# EAGLE design FDC1004Q (EAGLE 7.3.0)
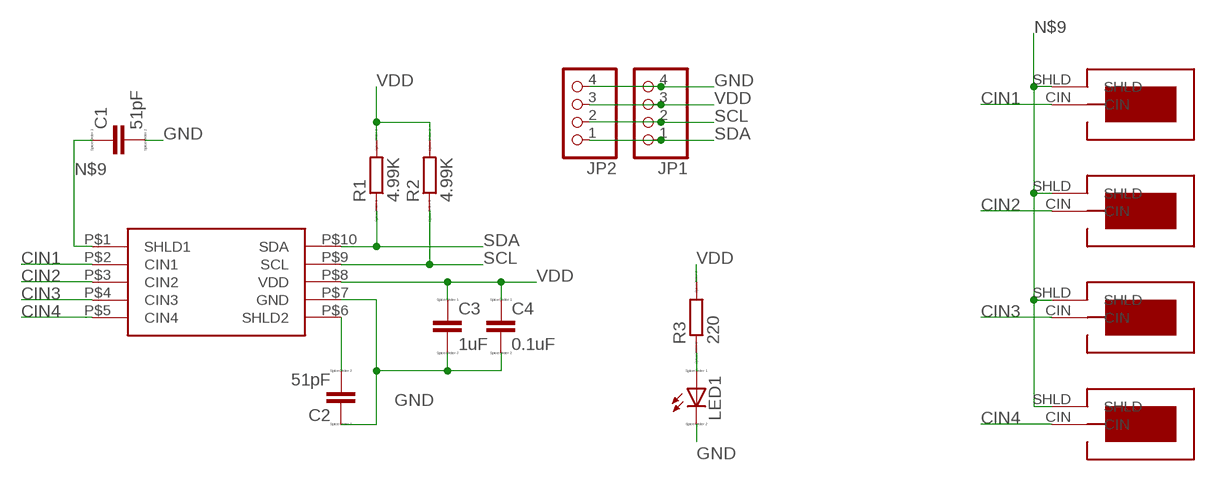
[diagram p0: schematic, sheet 1]

## Parts
C1  51pF  C  [C0805]
C2  51pF  C  [C0805]
C3  1uF  C  [C0805]
C4  0.1uF  C  [C0805]
JP1  PINHD-1X4  [1X04]
JP2  PINHD-1X4  [1X04]
LED1  LED_ESML0603  [LED_SML0603]
R1  4.99K  R  [R0805]
R2  4.99K  R  [R0805]
R3  220  R  [R0805]
SENSOR1  SENSOR  [SENSOR_1X1]
SENSOR2  SENSOR  [SENSOR_1X1]
SENSOR3  SENSOR  [SENSOR_1X1]
SENSOR4  SENSOR  [SENSOR_1X1]
U$1  FDC1004Q  [DGS]

## Nets
CIN1: SENSOR1.CIN U$1.P$2(CIN1)
CIN2: SENSOR2.CIN U$1.P$3(CIN2)
CIN3: SENSOR3.CIN U$1.P$4(CIN3)
CIN4: SENSOR4.CIN U$1.P$5(CIN4)
GND: C1.2 C2.1 C3.2 C4.2 JP1.4 JP2.4 LED1.C U$1.P$7(GND)
N$1: LED1.A R3.1
N$2: C2.2 U$1.P$6(SHLD2)
N$9: C1.1 SENSOR1.SHLD SENSOR2.SHLD SENSOR3.SHLD SENSOR4.SHLD U$1.P$1(SHLD1)
SCL: JP1.2 JP2.2 R2.1 U$1.P$9(SCL)
SDA: JP1.1 JP2.1 R1.1 U$1.P$10(SDA)
VDD: C3.1 C4.1 JP1.3 JP2.3 R1.2 R2.2 R3.2 U$1.P$8(VDD)

## Library data of the parts
C1-C4 = eagle-ltspice:C: CAPACITOR, European symbol; SPICEMODEL: NONE; SPICEPREFIX: C
JP1 JP2 = pinhead:PINHD-1X4: PIN HEADER
LED1 = eagle-ltspice:LED_E: LED Source: http://www.osram.convergy.de Source: www.luxeon.com Source: www.kingbright.com; SPICEMODEL: NONE; SPICEPREFIX: D; SPICETYPE: diode
R1-R3 = eagle-ltspice:R: RESISTOR, European symbol; SPICEMODEL: NONE; SPICEPREFIX: R
SENSOR1-SENSOR4 = DGS:SENSOR
U$1 = DGS:FDC1004Q

## Board
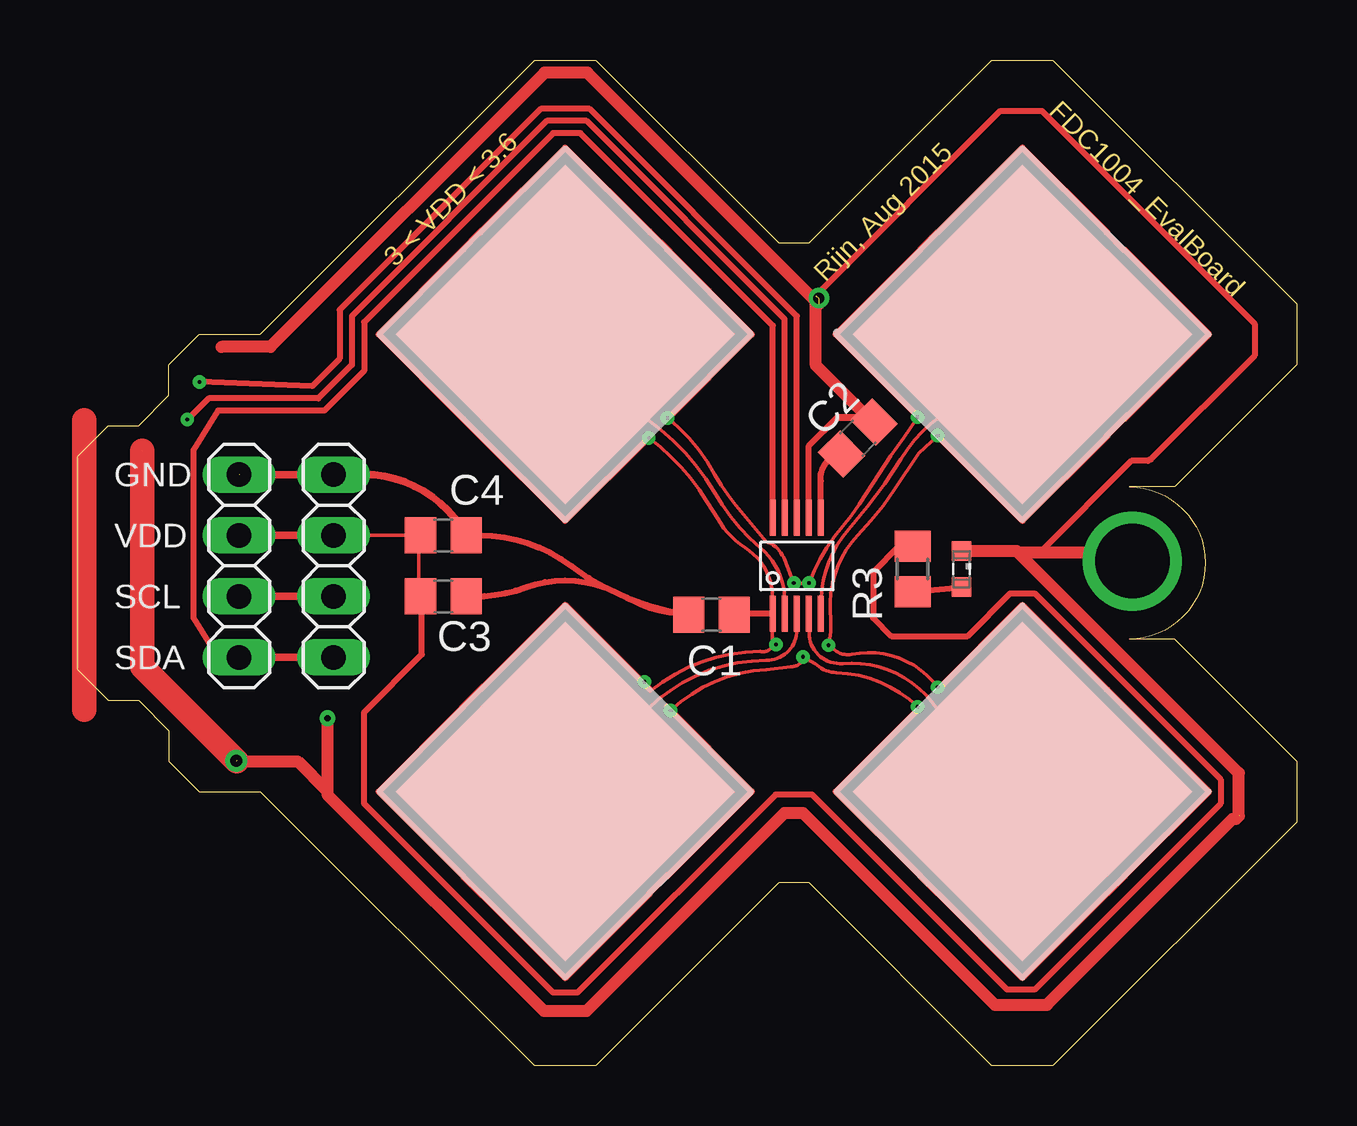
[diagram p1: board, top side]
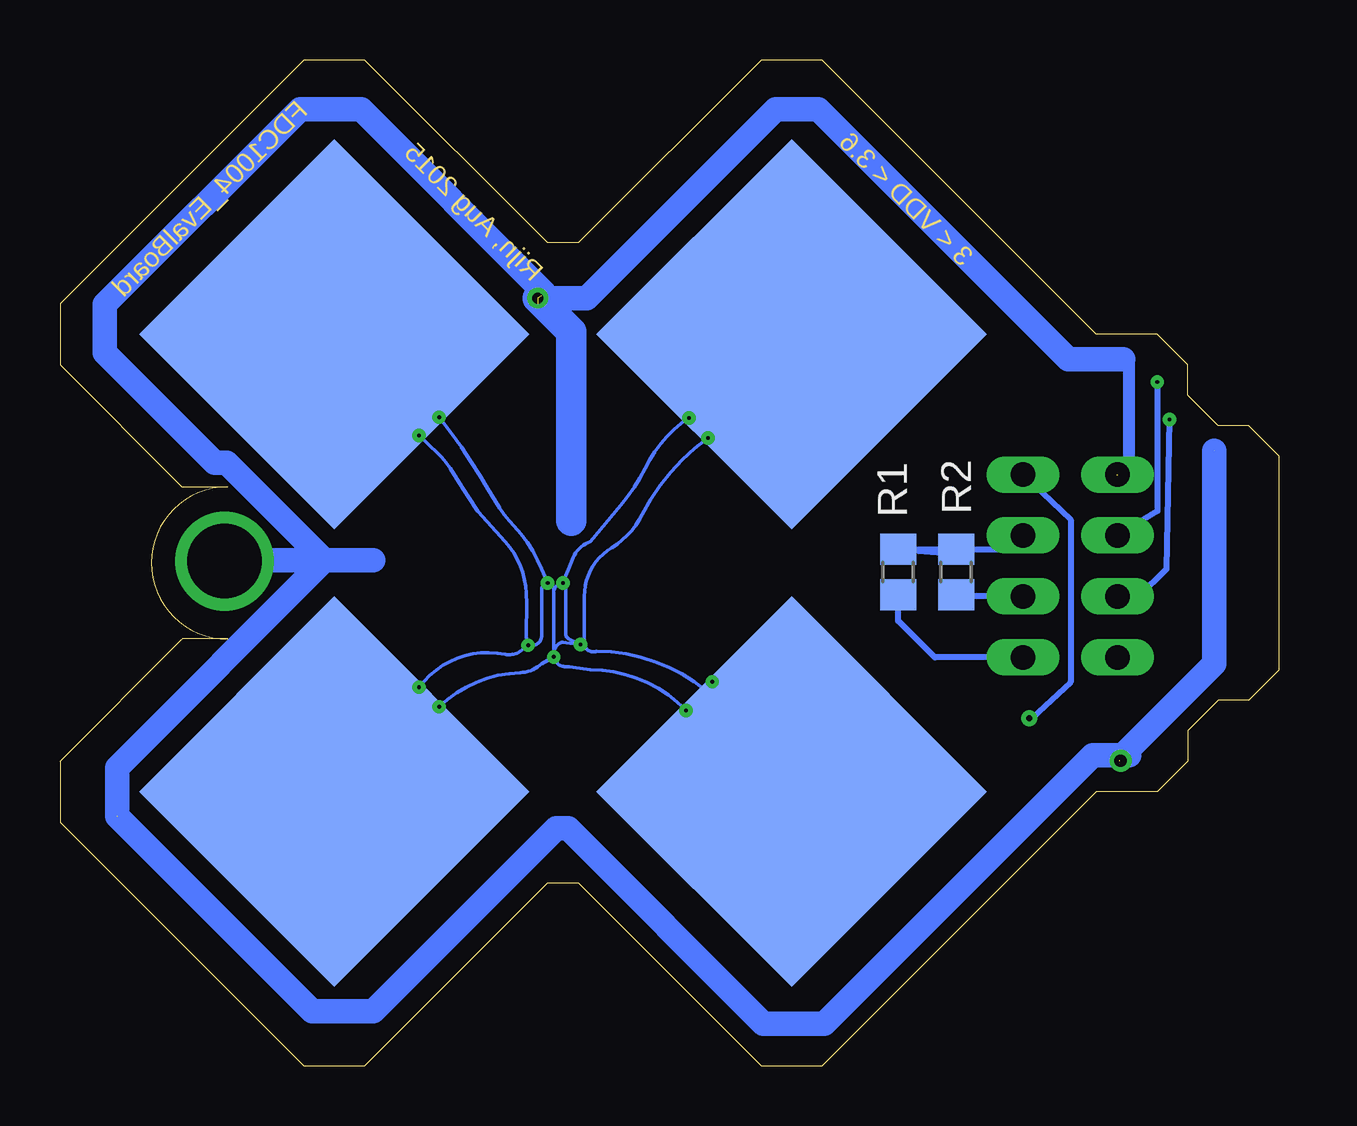
[diagram p2: board, bottom side, seen from below]

Size 50.8 x 41.91 mm. Coordinates in mm from the lower left corner, seen from the top.
Outline: 45.72,17.78 50.8,12.7 50.8,10.16 40.64,0 38.1,0 30.48,7.62 29.21,7.62 21.59,0 19.05,0 7.62,11.43 5.08,11.43 3.81,12.7 3.81,13.97 2.54,15.24 1.27,15.24 0,16.51 0,25.4 1.27,26.67 2.54,26.67 3.81,27.94 3.81,29.21 5.08,30.48 7.62,30.48 19.05,41.91 21.59,41.91 29.21,34.29 30.48,34.29 38.1,41.91 40.64,41.91 50.8,31.75 50.8,29.21 45.72,24.13 43.81,24.13 arc-180 43.81,17.78
Outline: 43.82,17.79 45.7,17.79 45.73,17.76
Copper layers (1*16): Top 0.035mm / dielectric 1.5mm / Bottom 0.035mm
Design rules "default *": minimum track width 5mil, minimum drill 6mil, track to track 0mil, track to pad 0mil, pad to pad 0mil, via to via 0mil, smd to smd 0mil, copper to edge 0mil, drill to drill 0mil, minimum pad ring 10mil, minimum via ring 8mil, stop-mask expansion 4mil, vias tented up to drill 0mil, thermal gap 10mil

### Footprints (pad centres in the part's own frame; a part is rotated, then mirrored left to right if it is on the bottom)
C0805 = smd 1.3 x 1.5: 1 -0.95,0; 2 0.95,0
1X04 = drill 1.016 long: 1 -3.81,0; 2 -1.27,0; 3 1.27,0; 4 3.81,0
LED_SML0603 = smd 0.8 x 0.8: A 0.75,0; C -0.75,0
R0805 = smd 1.3 x 1.5: 1 -0.95,0; 2 0.95,0
SENSOR_1X1 = smd 10 x 10: CIN 0,0 | smd 11.5 x 11.5 bottom: SHLD 0,0
DGS = smd 0.25 x 1.5: P$1 -1,-2; P$2 -0.5,-2; P$3 0,-2; P$4 0.5,-2; P$5 1,-2; P$6 1,2; P$7 0.5,2; P$8 0,2; P$9 -0.5,2; P$10 -1,2

### Placement (x,y rotation side)
C1  26.42,18.8 180 top
C2  32.51,26.16 225 top
C3  15.24,19.56 0 top
C4  15.24,22.1 0 top
JP1  6.73,20.83 90 top
JP2  10.67,20.83 90 top
LED1  36.83,20.7 270 top
R1  15.88,20.57 90 bottom
R2  13.46,20.57 90 bottom
R3  34.8,20.7 90 top
SENSOR1  20.32,30.48 45 top
SENSOR2  20.32,11.43 45 top
SENSOR3  39.37,11.43 45 top
SENSOR4  39.37,30.48 45 top
U$1  29.97,20.83 0 top

### Tracks (layer width: path | path; a pad name or v marks a point on that pad's centre or on a via)
CIN1
  Top 0.152: U$1.P$2 29.46,19.43 arc49 28.45,21.59 arc-20 26.54,23.88 arc25 23.75,26.92 arc-22 SENSOR1.CIN
CIN2
  Top 0.152: U$1.P$3 29.97,18.16 arc-90 28.7,16.89 arc45 23.75,14.86 arc1 SENSOR2.CIN
CIN3
  Top 0.152: U$1.P$4 30.48,18.03 arc94 31.88,16.76 arc-61 35.81,14.86 arc25 SENSOR3.CIN
CIN4
  Top 0.152: U$1.P$5 30.99,19.43 arc-40 32.13,22.35 arc10 34.29,25.27 arc-22 35.94,27.05 arc18 SENSOR4.CIN
GND  (via drill 0.25 pad 0.51, 0.46, 0.51, 3.1 pad 0.25)  (6 unrouted)
  Top 0.152: C4.2 16.76,22.1 | C3.2 16.51,19.56 | 21.97,19.94 arc-13 22.73,19.56 arc35 C1.2
  Top 0.254: 16.76,22.1 arc-37 20.57,20.83 arc29 C1.2 | 16.51,19.56 arc20 18.67,19.94 arc-40 21.97,19.94 | 30.47,25.83 U$1.P$7 | 30.47,25.83 31.65,27.01 32.28,27.01 32.45,26.83 C2.1 | 30.47,25.83 30.47,25.84 31.68,27.05 33.2,27.05 33.09,26.93 33.09,26.83 30.75,29.17 30.75,32.09 38.45,39.79 40.18,39.79 49.04,30.92 49.04,29.59 44.72,25.27 44.67,25.27 44.61,25.21 43.91,25.21 40.15,21.45 LED1.C
  Top 0.305: C4.2 arc62 11.94,24.64 JP2.4 JP1.4
  Top 0.508: v10.41,14.48 10.41,11.45 | 39.2,21.38 48.39,12.19 48.39,10.41 48.26,10.29 48.13,10.29 40.39,2.54 38.23,2.54 30.23,10.54 29.46,10.54 21.21,2.29 19.43,2.29 10.41,11.3 10.41,11.45 | 39.2,21.38 39.13,21.45 LED1.C | v43.95,21.03 43.6,21.38 39.2,21.38 | 6.65,12.73 6.7,12.68 9.18,12.68 10.41,11.45 | 30.89,31.73 21.24,41.39 19.46,41.39 8.03,29.96 6,29.96
  Top 1.016: 6.64,12.68 v6.61,12.71 2.7,16.62 2.7,25.64
  Bottom 0.254: JP2.4 8.69,22.76 8.69,15.99 10.3,14.48 v10.41,14.48
  Bottom 0.508: 6.76,24.62 6.25,25.13 6.25,29.19
  Bottom 1.016: 30.64,32.24 38.26,39.86 40.8,39.86 48.93,31.73 48.93,29.7 44.35,25.13 43.85,25.13 39.78,21.07 | 39.78,21.07 37.75,21.07 | 39.78,21.07 43.85,21.07 | 39.78,21.07 48.42,12.43 48.42,10.4 40.29,2.27 37.75,2.27 30.13,9.89 29.62,9.89 21.49,1.76 18.95,1.76 7.78,12.94 6.25,12.94 | v30.89,31.99 28.86,31.99 20.99,39.86 19.21,39.86 8.79,29.45 6.51,29.45 | 6.64,12.81 2.7,16.75 2.7,25.64
  Bottom 1.27: v30.89,31.99 29.49,30.59 29.49,22.72
N$1
  Top 0.254: R3.1 LED1.A
N$2
  Top 0.254: U$1.P$6 30.97,24.37 arc-90 C2.2
N$3
  Top 0.254: 16.01,14.92 16.92,15.83
N$4
  Top 0.254: 16.06,7.91 16.87,7.1
N$5
  Top 0.254: 23.83,7.2 24.59,7.96
N$9  (via drill 0.15 pad 0.25)
  Top 0.152: v35.84,26.26 35.05,25.53 34.04,24 arc-10 32.51,22.1 arc48 31.37,18.92 arc-18 v31.29,17.53 31.62,17.27 arc45 32.26,17.14 arc-65 v35.84,15.77 | 28.96,17.53 U$1.P$1 28.96,19.56 arc56 27.81,21.59 arc-25 26.8,22.61 arc0 25.91,24 arc18 v23.8,26.16 | 28.96,17.53 arc-89 28.45,17.27 arc38 23.88,15.62 v23.62,16 | 28.96,17.53 29.21,17.53 v29.11,17.55 | v24.71,14.81 arc-40 28.7,16.51 29.72,16.64 arc90 v30.23,17.04 30.73,16.76 arc44 31.62,16.38 arc-42 v35,14.96 | v35,27.03 34.42,26.16 arc4 32.89,23.88 arc-8 31.88,22.48 arc20 v30.48,20.12 v29.84,20.12 29.46,21.08 arc49 28.7,21.84 27.43,23.37 arc-10 26.54,24.64 arc23 v24.59,27
  Top 0.254: U$1.P$1 27.4,18.83 arc90 C1.1
  Bottom 0.152: 23.88,15.62 arc-40 28.45,17.27 arc90 28.96,17.53 28.96,19.56 arc59 27.81,21.59 arc-33 26.54,22.99 arc26 v23.8,26.16 SENSOR1.SHLD arc90 23.88,26.92 v24.59,27 arc-31 26.42,24.89 arc12 27.43,23.37 28.7,21.84 arc-49 29.46,21.08 v29.84,20.12 | v31.29,17.53 31.11,17.53 arc-90 30.73,17.91 30.73,19.81 arc90 v30.48,20.12 | v23.62,16 20.32,16 SENSOR2.SHLD | v30.23,17.04 arc90 29.84,17.65 v29.11,17.55 29.59,17.78 arc74 29.72,18.03 29.72,19.94 arc-90 v29.84,20.12 | SENSOR2.SHLD 20.95,11.43 v24.71,14.81 arc-46 28.7,16.51 29.59,16.64 arc90 v30.23,17.04 | SENSOR2.SHLD 23.24,14.35 25.02,14.35 | v30.23,17.04 30.23,19.68 | 30.23,19.68 30.23,19.81 arc-90 v30.48,20.12 | 30.23,19.68 arc90 v29.84,20.12 | v31.29,17.53 31.62,17.27 arc45 32.26,17.14 arc-65 v35.84,15.77 SENSOR3.SHLD | v30.23,17.04 30.73,16.76 arc44 31.62,16.38 arc-42 v35,14.96 | v30.48,20.12 30.73,20.7 arc-22 31.88,22.48 arc14 32.64,23.5 arc-3 33.66,25.15 arc-6 v35,27.03 35.94,27.05 arc90 SENSOR4.SHLD | v35.84,26.26 35.05,25.53 arc13 34.54,24.89 arc-1 33.4,23.11 32.26,21.84 arc39 31.37,19.68 arc6 31.37,18.41 arc-22 v31.29,17.53
N$12
  Top 1.016: 0.29,26.91 0.29,14.84
N$15
  Top 0.254: 16.87,34.83 15.91,33.87
N$16
  Top 0.254: 16.06,26.96 16.82,26.2
N$17
  Top 0.254: 23.83,34.78 24.69,33.92
N$18
  Top 0.254: 35.82,34.73 35.11,34.02
N$19
  Top 0.254: 42.88,34.73 43.64,33.97
N$20
  Top 0.254: 42.88,26.25 43.74,27.11
N$21
  Top 0.254: 42.88,15.68 43.54,15.02
N$22
  Top 0.254: 42.93,7.2 43.64,7.91
N$23
  Top 0.254: 35.11,7.91 35.82,7.2
N$26
  Top 0.508: 33.12,26.83 30.76,29.18 30.76,32
SCL  (via drill 0.15 pad 0.25)
  Top 0.254: U$1.P$9 29.47,23.23 29.46,23.24 29.46,31.12 21.21,39.37 19.56,39.37 11.43,31.24 11.43,29.21 10.03,27.81 5.46,27.81 v4.57,26.92
  Top 0.305: JP1.2 JP2.2
  Bottom 0.254: JP2.2 13.4,19.56 R2.1 | v4.57,26.92 4.7,20.7 5.84,19.56 JP1.2
SDA
  Top 0.254: U$1.P$10 28.97,30.84 20.95,38.86 19.81,38.86 11.94,30.99 11.94,28.96 10.29,27.3 5.84,27.3 4.83,25.65 4.83,18.67 5.84,17.02 JP1.1
  Top 0.305: JP1.1 JP2.1
  Bottom 0.254: JP2.1 14.35,17.02 15.88,18.54 R1.1
VDD  (via drill 0.15 pad 0.25)
  Top 0.152: JP2.3 C4.1 arc90 14.22,22.03 14.22,20.07 arc-90 14.29,20 C3.1
  Top 0.254: U$1.P$8 29.97,31.24 21.34,39.88 19.3,39.88 10.92,31.5 10.92,29.46 9.78,28.32 v5.08,28.5 | R3.2 34.22,21.65 33.15,20.57 33.15,18.67 33.91,17.91 37.08,17.91 38.86,19.68 39.88,19.68 47.62,11.94 47.62,10.92 39.88,3.17 38.73,3.17 30.61,11.3 29.08,11.3 20.83,3.05 19.81,3.05 11.94,10.92 11.94,14.73 14.35,17.14 14.35,19.5 C3.1
  Top 0.305: JP1.3 JP2.3
  Bottom 0.254: JP2.3 10.73,21.52 R2.2 R1.2 13.46,21.34 | v5.08,28.5 5.08,23.11 JP1.3

### Text on the board
Dimension: FDC1004_EvalBoard | 3 < VDD < 3.6 | Rijn, Aug 2015
tNames: GND | VDD | SCL | SDA